# EasyEDA Pro project TTMT_ENTIRE_EASYEDA_PROJECT.epro, board PCB2
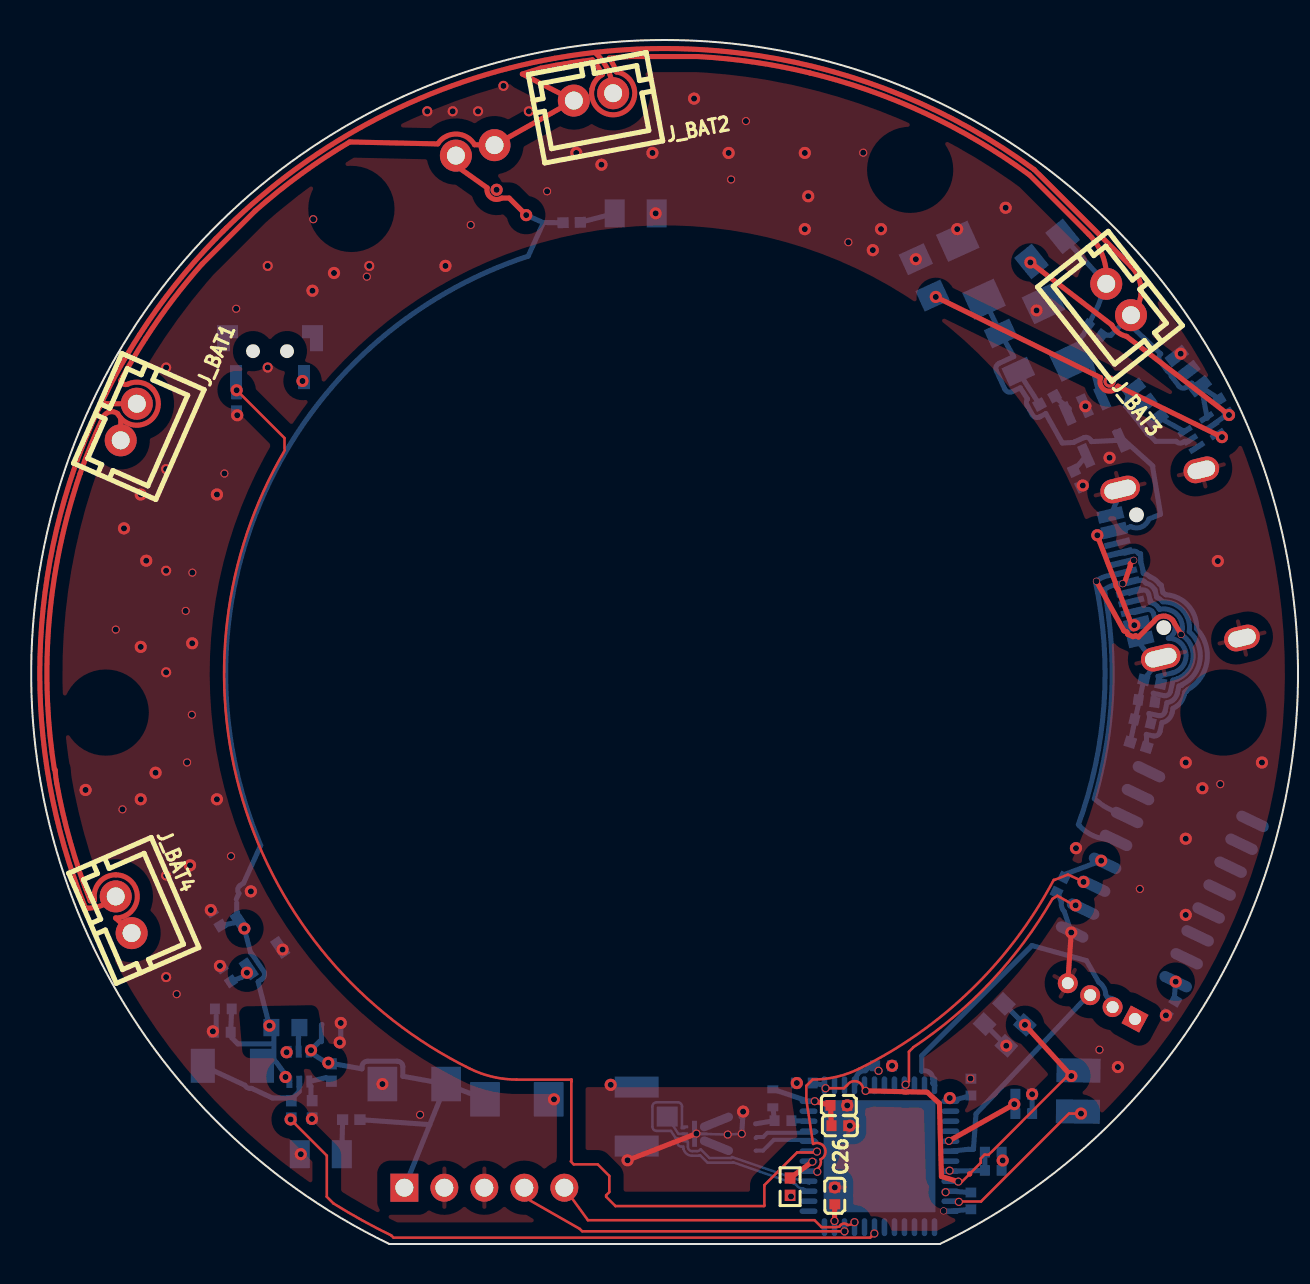
[diagram p10: board, top side]
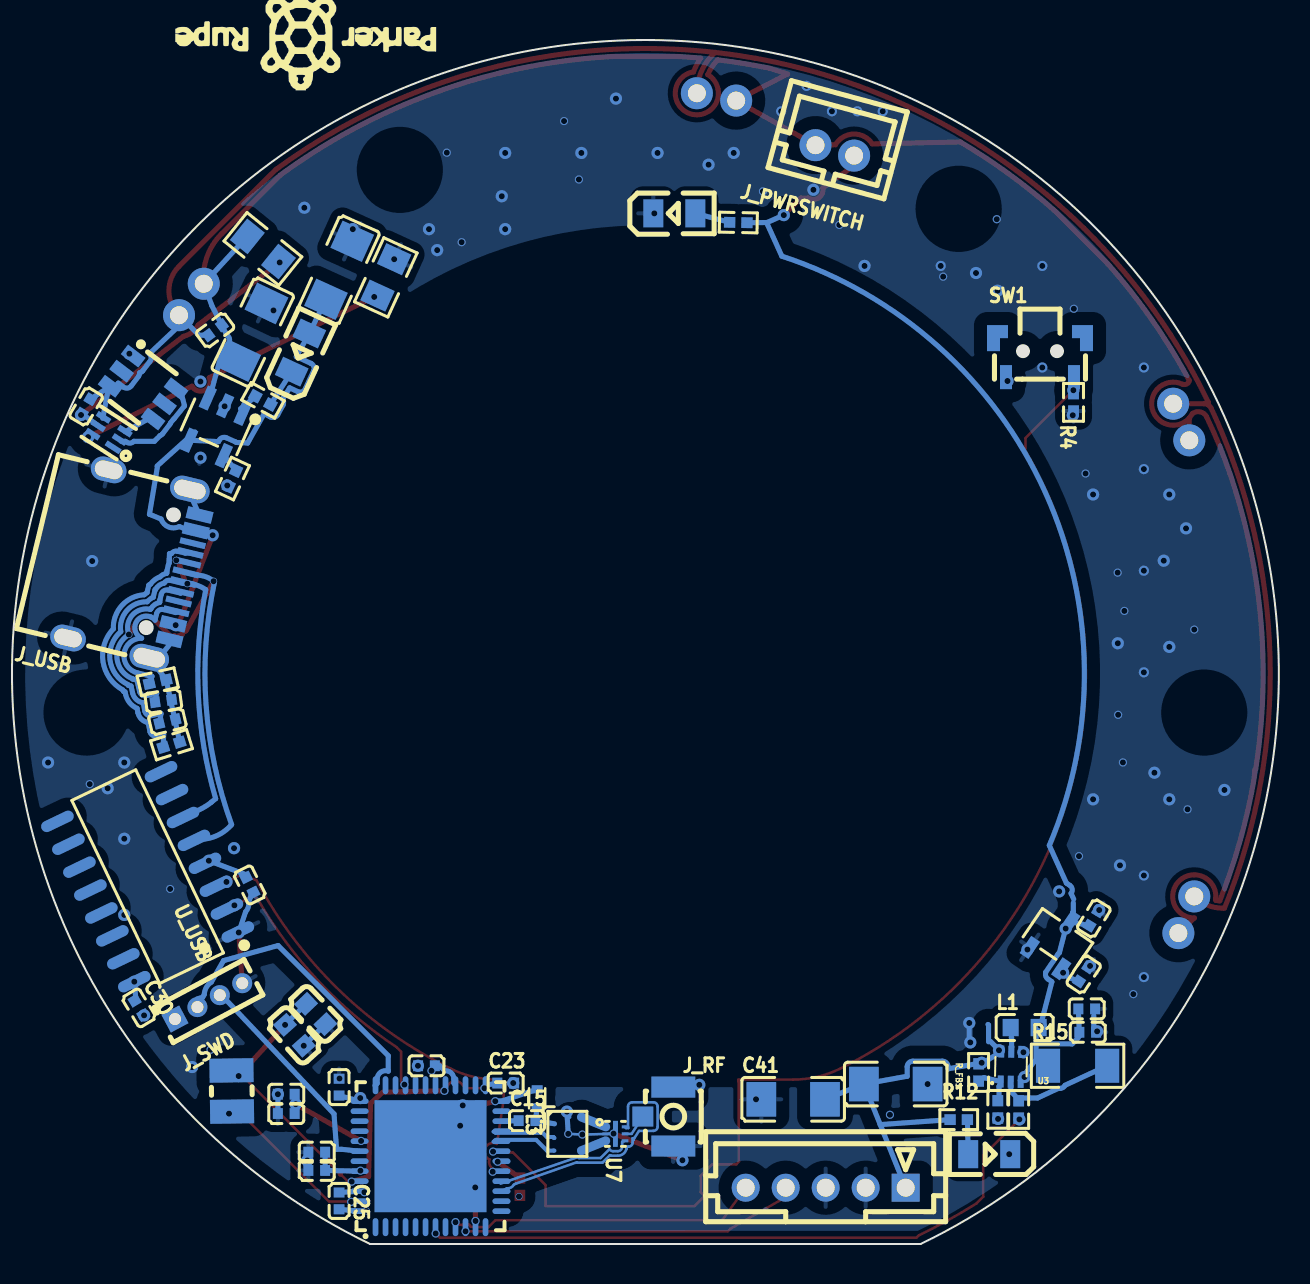
[diagram p11: board, bottom side, seen from below]

Outline 63.35 x 60.2 mm; copper layers: Top Layer, UpperGND, 3V3, Bottom Layer. Coordinates in mm from the lower left corner of the outline.
Outline path: 17.91,0 45.44,0 arc(31.67,60.2) 17.91,0
Stack: Top Layer 0.035mm Outer layer thickness 1oz / Dielectric1 0.2104mm 7628 RC49% 8.6mil / UpperGND 0.0152mm Inner layer thickness / Dielectric2 1.065mm 1.1mm H/HOZ Copper / 3V3 0.0152mm Inner layer thickness / Dielectric3 0.2104mm 7628 RC49% 8.6mil / Bottom Layer 0.035mm Outer layer thickness 1oz

## Design rules (mm)
net OUT2: DP1
net OUT1: DP1
template: Custom Config
spacing copperThickness1oz (default): track to track 0.025, other pairs 0.025 to 0.3
spacing copperThickness2oz: track to track 0.025, other pairs 0.025 to 0.3
track width copperThickness1oz (default): min 0.127, default 0.254, max 2.54
track width copperThickness2oz: min 0.203, default 0.254, max 2.54
differential pair RFpair (default): width min 0.445, default 0.445, max 0.445; gap min 0.203, default 0.203
via viaSize (default): diameter min 0.3, default 0.61, max 10; hole min 0.3, default 0.305, max 6.3

## Placement (name value [footprint] x y rotation side)
C7  10uF  [C0402]  53.19 45.69 143.4 bottom
C13  68pF  [C0402]  40.44 5.91 180 top
C15  12pF  [C0402]  37.59 6.17 180 bottom
C21  100nF  [C0402]  46.99 7.84 90 bottom
C22  100nF  [C0402]  42.62 8.91 0 bottom
C23  100nF  [C0402]  38.66 8.05 180 bottom
C24  100nF  [C0402]  48.11 4.59 0 bottom
C25  100nF  [C0402]  46.99 2.16 270 bottom
C26  100nF  [C0402]  40.18 2.41 270 top
C27  100nF  [C0402]  9.24 16.28 301.1 bottom
C28  100nF  [C0402]  9.75 13.48 303.7 bottom
C29  100nF  [C0402]  51.46 17.95 63.4 bottom
C30  100nF  [C0402]  57 11.81 239 bottom
C31  1uF  [C0402]  49.63 7.49 0 bottom
C33  10nF  [C0402]  49.63 6.52 0 bottom
C34  4.7uF  [C0402]  48.11 3.68 0 bottom
C35  470nF  [C0603]  48.16 11.5 226.3 bottom
C36  470nF  [C0603]  49.22 10.44 228.2 bottom
C37  47nF  [C0402]  40.39 6.93 180 top
C38  4.7uF  [C1206]  51.31 45.59 295.4 bottom
C39  4.7uF  [C1206]  46.99 48.69 114.4 bottom
C40  100nF  [C0402]  59.64 41.88 301 bottom
C41  22uF  [C1206]  24.28 7.24 180 bottom
C42  22uF  [C1206]  19.15 8 0 bottom
C43  1uF  [C0402]  9.6 11.76 0 bottom
C44  10uF  [C0402]  9.55 10.59 0 bottom
C45  10uF  [C0402]  55.78 27.15 172 bottom
C46  10uF  [C0402]  55.57 26.13 166.5 bottom
FL1  BALFHB-WL-05D3  [CSPG-8_L2.1-W1.8_BALFHB-WL-03D3]  35.56 5.51 180 bottom
J_BAT1  B2B-PH-K-S(LF)(SN)  [CONN-TH_B2B-PH-K-S]  4.87 41.1 246.2 top
J_BAT2  B2B-PH-K-S(LF)(SN)  [CONN-TH_B2B-PH-K-S]  28.11 57.36 190.6 top
J_BAT3  B2B-PH-K-S(LF)(SN)  [CONN-TH_B2B-PH-K-S]  54.38 47.23 128.2 top
J_BAT4  B2B-PH-K-S(LF)(SN)  [CONN-TH_B2B-PH-K-S]  4.62 16.46 293.4 top
J_CAM  B5B-PH-K-S(LF)(SN)  [CONN-TH_B5B-PH-K-S-LF-SN]  22.66 2.81 180 bottom
J_PWRSWITCH  B2B-PH-K-S(LF)(SN)  [CONN-TH_B2B-PH-K-S]  22.2 54.68 195.1 bottom
J_RF  6GHz  [IPEX-SMD_BWIPX-1-001E]  31.04 6.37 180 bottom
J_SWD  PZ127V-11-04-0720  [HDR-TH_4P-P1.27-V-M]  53.51 12.14 152 bottom
J_USB  TYPE-C-31-M-12  [USB-C_SMD-TYPE-C-31-M-12_1]  57.12 33.92 283.6 bottom
L1  1uH  [L0603]  12.7 10.82 180 bottom
L3  3.9nH  [IND-SMD_L1.0-W0.5-2]  37.08 7.29 90 bottom
L_SMPS  15uH  [IND-SMD_L2.5-W2.0]  52.36 7.65 269.2 bottom
LED4  KT-0805G  [LED0805-R-RD]  48.92 44.57 114.8 bottom
LED5  KT-0805G  [LED0805-R-RD]  30.23 51.53 180 bottom
LED6  KT-0805G  [LED0805-R-RD]  14.48 4.49 0 bottom
Q_BMS  FS8205A  [SOT-23-6_L2.9-W1.6-P0.95-LS2.8-BR]  56.79 42.83 37.3 bottom
R4  10kΩ  [R0402]  10.26 42.08 90 bottom
R5  10kΩ  [R0402]  37.95 2.87 90 top
R6  5.1kΩ  [R0402]  55.37 24.96 342.7 bottom
R7  5.1kΩ  [R0402]  56.06 28.11 347.2 bottom
R8  1kΩ  [R0402]  27.02 51.08 181.2 bottom
R9  2kΩ  [R0402]  52.32 38.27 115 bottom
R10  330Ω  [R0805]  50.8 49.75 38.9 bottom
R11  2.2kΩ  [R0805]  44.65 48.33 114.6 bottom
R12  1kΩ  [R0402]  16 6.22 180 bottom
R13  10kΩ  [R0402]  14.05 6.73 90 bottom
R14  10kΩ  [R0402]  13 6.73 90 bottom
R15  100kΩ  [R1206]  10.06 8.91 180 bottom
R_FB1  73.2kΩ  [R0402]  15.01 8.58 270 bottom
R_STAT  470Ω  [R0402]  50.8 42.18 28.8 bottom
SW1  TS24CA  [SW-SMD_2P-TS24CA]  11.94 44.32 180 bottom
U2  MCP73831T-2ACI/OT  [SOT-23-5_L3.0-W1.7-P0.95-LS2.8-BL]  53.16 40.86 23.9 bottom
U3  TPS61023DRLR  [SOT-563_L1.6-W1.2-P0.50-LS1.6-BR]  13.39 8.87 271.1 bottom
U4  XC6206P332MR  [SOT-23-3_L3.0-W1.7-P0.95-LS2.9-BR]  11.04 15.21 304.3 bottom
U6  BQ29700DSER  [WSON-6_L1.5-W1.5-P0.50-TL]  58.51 40.57 32.8 bottom
U7  SKY13351-378LF  [DFN-6_L1.0-W1.0-P0.35-BL-EP0.15]  33.17 5.51 270 bottom
U8  STM32WLE5CCU6  [UFQFPN-48_L7.0-W7.0-P0.50-BL-EP5.6]  42.42 4.39 180 bottom
U_USB  CH340C  [SOP-16_L10.0-W3.9-P1.27-LS6.0-BL]  56.56 18.37 64.4 bottom

## Footprints (pads in the part's own frame, mm; a bottom-side part is the same pattern mirrored in y, then rotated)
C0402
  rect 0.5x0.54 smd: 1(-0.42,0) 2(0.42,0)
C0603
  rect 0.8x0.9 smd: 1(-0.7,0) 2(0.7,0)
C1206
  rect 1.485x1.728 smd: 1(-1.593,0) 2(1.593,0)
CONN-TH_B2B-PH-K-S
  round 1.6 hole 0.9: 1(1,0) 2(-1,0)
CONN-TH_B5B-PH-K-S-LF-SN
  rect 1.4x1.4 hole 0.9: 1(4,0)
  round 1.4 hole 0.9: 2(2,0) 3(0,0) 4(-2,0) 5(-4,0)
CSPG-8_L2.1-W1.8_BALFHB-WL-03D3
  round 0.204 smd: A1(-0.69,0.5) A2(-0.69,-0.21) A3(-0.69,-0.84) B1(0.085,0.84) B2(0,0) C1(0.69,0.84) C2(0.69,0) C3(0.69,-0.84)
DFN-6_L1.0-W1.0-P0.35-BL-EP0.15
  rect 0.15x0.33 smd: 1(-0.35,-0.485) 3(0.35,-0.485) 4(0.35,0.485) 5(0,0.485) 6(-0.35,0.485)
  custom 1.3x0.78 smd: 2(0,-0.263)
HDR-TH_4P-P1.27-V-M
  rect 1x1 hole 0.6: 1(-1.905,0)
  round 1 hole 0.6: 2(-0.635,0) 3(0.635,0) 4(1.905,0)
IND-SMD_L1.0-W0.5-2
  rect 0.4x0.55 smd: 1(-0.45,0) 2(0.45,0)
IND-SMD_L2.5-W2.0
  rect 1.2x2.2 smd: 1(1.028,0) 2(-1.028,0)
IPEX-SMD_BWIPX-1-001E
  rect 1.05x1 smd: 1(-0.762,0)
  rect 2.2x1.05 smd: 2(0.762,-1.475) 3(0.762,1.475)
L0603
  rect 0.8x0.864 smd: 1(-0.7,0) 2(0.7,0)
LED0805-R-RD
  rect 1x1.399 smd: 1(1.05,0) 2(-1.05,0)
R0402
  rect 0.566x0.54 smd: 1(-0.433,0) 2(0.433,0)
R0805
  rect 1.133x1.377 smd: 1(-1,0) 2(1,0)
R1206
  rect 1.208x1.701 smd: 1(-1.479,0) 2(1.479,0)
SOP-16_L10.0-W3.9-P1.27-LS6.0-BL
  oval 0.56x1.745 smd: 1(-4.445,-2.873) 2(-3.175,-2.873) 3(-1.905,-2.873) 4(-0.635,-2.873) 5(0.635,-2.873) 6(1.905,-2.873) 7(3.175,-2.873) 8(4.445,-2.873) 9(4.445,2.873) 10(3.175,2.873) 11(1.905,2.873) 12(0.635,2.873) 13(-0.635,2.873) 14(-1.905,2.873) 15(-3.175,2.873) 16(-4.445,2.873)
SOT-23-3_L3.0-W1.7-P0.95-LS2.9-BR
  rect 1.038x0.532 smd: 1(1.101,-0.95) 2(1.101,0.95) 3(-1.101,0)
SOT-23-5_L3.0-W1.7-P0.95-LS2.8-BL
  rect 0.49x1.157 smd: 1(-0.95,-1.153) 2(0,-1.153) 3(0.95,-1.153)
  rect 0.49x1.175 smd: 4(0.95,1.153) 5(-0.95,1.153)
SOT-23-6_L2.9-W1.6-P0.95-LS2.8-BR
  rect 1.1x0.6 smd: 1(1.35,-0.95) 2(1.35,0) 3(1.35,0.95) 4(-1.35,0.95) 5(-1.35,0) 6(-1.35,-0.95)
SOT-563_L1.6-W1.2-P0.50-LS1.6-BR
  rect 0.6x0.3 smd: 1(0.75,-0.5) 2(0.75,0) 3(0.75,0.5) 4(-0.75,0.5) 5(-0.75,0) 6(-0.75,-0.5)
SW-SMD_2P-TS24CA
  rect 0.6x1.2 smd: 1(-1.7,-0.975) 2(1.7,-0.975)
  custom 1.05x1.3 smd: 3(2.125,0.975) 4(-2.125,0.975)
UFQFPN-48_L7.0-W7.0-P0.50-BL-EP5.6
  oval 0.28x0.9 smd: 1(-2.751,-3.547) 2(-2.251,-3.547) 3(-1.75,-3.547) 4(-1.25,-3.547) 5(-0.75,-3.547) 6(-0.249,-3.547) 7(0.249,-3.547) 8(0.75,-3.547) 9(1.25,-3.547) 10(1.75,-3.547) 11(2.251,-3.547) 12(2.751,-3.547) 25(2.751,3.547) 26(2.251,3.547) 27(1.75,3.547) 28(1.25,3.547) 29(0.75,3.547) 30(0.249,3.547) 31(-0.249,3.547) 32(-0.75,3.547) 33(-1.25,3.547) 34(-1.75,3.547) 35(-2.251,3.547) 36(-2.751,3.547)
  oval 0.9x0.28 smd: 13(3.547,-2.75) 14(3.547,-2.25) 15(3.547,-1.75) 16(3.547,-1.25) 17(3.547,-0.75) 18(3.547,-0.25) 19(3.547,0.25) 20(3.547,0.75) 21(3.547,1.25) 22(3.547,1.75) 23(3.547,2.25) 24(3.547,2.75) 37(-3.547,2.751) 38(-3.547,2.251) 39(-3.547,1.75) 40(-3.547,1.25) 41(-3.547,0.75) 42(-3.547,0.249) 43(-3.547,-0.249) 44(-3.547,-0.75) 45(-3.547,-1.25) 46(-3.547,-1.75) 47(-3.547,-2.251) 48(-3.547,-2.751)
  rect 5.6x5.6 smd: 49(0,0)
USB-C_SMD-TYPE-C-31-M-12_1
  oval 1.2x2 hole 0.8x1.6: 1(4.325,1.706) 4(-4.325,1.706)
  oval 1.2x1.8 hole 0.8x1.4: 2(4.325,-2.474) 3(-4.325,-2.474)
  custom 0.6x1.3 smd: A1B12(-3.2,2.474) A4B9(-2.4,2.474) B1A12(3.2,2.474) B4A9(2.401,2.474)
  rect 0.3x1.3 smd: A5(-1.25,2.474) A6(-0.25,2.474) A7(0.25,2.474) A8(1.25,2.474) B5(1.75,2.474) B6(0.75,2.474) B7(-0.75,2.474) B8(-1.75,2.474)
WSON-6_L1.5-W1.5-P0.50-TL
  rect 0.84x0.28 smd: 1(-0.581,0.5)
  rect 0.75x0.28 smd: 2(-0.636,0) 3(-0.636,-0.5) 4(0.636,-0.5) 5(0.636,0) 6(0.636,0.5)

## Nets
As in the schematic.

Pads without a net: J_USB A8 B8; Q_BMS 2 5; SW1 3 4; U6 1; U8 1 2 3 4 5 6 8 12 13 14 23 26 27 30 31 32 34 35 38 39 40 43; U_USB 7 8 9 10 11 12 13 14 15

## Via types
v1: diameter 0.406, hole 0.305, Top Layer to Bottom Layer, 43 vias
v2: diameter 0.61, hole 0.305, Top Layer to Bottom Layer, 94 vias
v3: diameter 0.508, hole 0.305, Top Layer to Bottom Layer, 14 vias
v4: diameter 0.355, hole 0.305, Top Layer to Bottom Layer, 6 vias

## Routing (per net, layer and track width the routed paths; a pad name or vN(x,y) marks a point on that pad's centre or on a via; arc(x,y) is an arc through that point)
3V3: length 12.6
  Top Layer w0.254: v1(45.89,5.15) v2(49.16,6.99) ; v1(40.17,1.15) C26.2
  Bottom Layer w0.254: C22.1 41.96,8.91 41.71,8.66 arc(41.39,8.56) 41.25,8.25 41.25,8.05 U8.28 ; C28.2 10.51,13.33 v2(10.78,13.56) ; v2(57.23,13.12) 57.15,12.18 ; C25.1 U8.46 ; U8.37 C21.1 ; 47.69,4.39 C34.1 U8.44
  vias: v1(42.37,8.66) v1(45.73,2.59) v1(45.92,3.67) v2(13.56,43.15) v2(45.93,7.3) v4(37.99,2.38)
GND: length 24.4
  Top Layer w0.254: v2(29.82,4.19) v1(33.26,5.52) ; J_SWD.4 v2(52.01,15.58)
  Bottom Layer w0.127: v1(35.53,5.51) v1(34.83,5.47) U7.2
  Bottom Layer w0.254: 55.41,30.04 55.75,29.61 ; 51.32,17.66 51.51,17.08 arc(51.53,16.83) 51.66,16.61 v2(52.01,15.58) ; v2(35.6,6.62) v1(35.53,5.51) ; C35.2 v2(48.76,9.91) ; J_USB.1 R7.1 54.96,25.09 ; v2(15.47,11.05) 15.47,10.13 v2(15.42,10.08) ; v2(9.08,10.63) 9.25,10.8 9.25,11.41 ; 54.01,36.5 54.31,37.2 ; C33.2 v2(50.05,7.49) ; C24.2 C34.2 ; 46.99,1.73 45.96,1.64 ; 54.01,37.39 54.09,37.95
  vias: v1(4.22,30.72) v1(4.56,21.73) v1(7.27,12.49) v1(7.72,31.66) v1(7.79,24.08) v1(8.05,33.57) v1(8.03,26.46) v1(9.66,38.53) v1(9.99,19.39) v1(10.25,46.76) v1(14.1,51.24) v1(16.78,48.37) v1(19.44,6.46) v1(21.97,50.95) v1(25.79,52.63) v1(35,53.23) v1(35.74,56.15) v1(40.86,50.09) v1(41.6,54.57) v1(46.97,8.27) v1(53.42,9.71) v1(55.44,17.75) v1(59.46,22.99) v2(2.71,22.7) v2(4.63,35.78) v2(5.47,37.48) v2(5.47,29.86) v2(5.47,22.24) v2(5.75,34.17) v2(6.21,23.56) v2(7.94,18.93) v2(8.05,30.04) v2(8.98,16.7) v2(9.28,37.48) v2(9.28,22.24) v2(9.43,13.9) v2(10.3,41.44) v2(10.98,17.63) v2(12.57,14.72) v2(12.77,9.59) v2(13.48,4.49) v2(14.06,47.67) v2(14.03,6.25) v2(15.14,48.55) v2(17.56,8) v2(20.71,48.91) v2(23.27,52.71) v2(26.14,7.24) v2(27.25,54.55) v2(28.51,53.97) v2(28.98,7.96) v2(31.06,54.55) v2(31.23,51.53) v2(33.14,57.27) v2(34.87,54.55) v2(38.28,8.05) v2(38.68,54.55) v2(38.68,50.74) v2(38.85,52.39) v2(40.18,2.83) v2(40.81,6.93) v2(40.94,5.91) v2(42.08,49.7) v2(42.49,50.74) v2(43.05,8.91) v2(44.24,49.24) v2(46.3,50.74) v2(48.58,4.18) v2(48.73,51.81) v2(50.27,46.68) v2(52.24,19.79) v2(52.58,37.93) v2(52.71,41.89) v2(53.92,43.12) v2(53.92,39.31) v2(54.34,8.85) v2(56.74,11.43) v2(57.48,44.52) v2(57.73,24.07) v2(57.73,20.26) v2(57.73,16.45) v2(58.56,22.79) v2(59.34,34.15) v2(61.54,24.07) v3(6.74,43.83) v3(6.74,38.75) v3(6.74,33.67) v3(6.74,28.59) v3(6.74,18.43) v3(6.74,13.35) v3(11.82,48.91) v3(11.82,43.83) v3(16.9,48.91) v3(19.8,56.64) v3(21.07,56.64) v3(22.34,56.64) v3(23.61,57.91) v3(24.88,56.64) v4(45.62,1.66)
V5_CAM: length 20.7
  Bottom Layer w0.254: C42.2 19.93,5.97 ; C42.2 C41.2 ; C42.2 18.58,8.39 18.58,8.86 arc(18.5,9.06) 18.3,9.14 16.82,9.14 arc(16.62,9.06) 16.54,8.86 16.54,8.76 v2(14.85,9.06) ; 19.93,5.97 R12.1 ; 19.93,5.97 J_CAM.1 ; 14.18,9.9 14.43,10.14 ; 14.8,9.15 14.67,9.12 U3.6 ; 14.51,10.11 14.51,10.95 14.54,10.98 ; 13.91,9.62 14.18,9.89
  vias: v2(13.99,9.69)
VBAT: length 60.8
  Top Layer w0.254: v2(24.75,51.45) 23.9,52.3 23.54,52.3 ; 21.16,53.98 22.8,52.81 arc(22.99,52.32) 23.52,52.3
  Bottom Layer w0.254: C27.2 U4.3 ; v2(24.75,51.45) 25.59,51.08 R8.2 ; 12.92,8.17 12.31,9.01 ; v2(10.65,15.77) 10.97,14.56 arc(11,14.53) 11.03,14.5 11.65,13.59 11.66,13.53 arc(11.64,13.37) 11.54,13.25 11.37,13.13 11.34,13.1 v2(11.91,10.92) ; 10.27,17.05 10.27,16.62 10.31,16.58 ; 10.02,10.31 10.33,10.01 12.05,10.01 ; 25.61,51.07 24.85,49.39 arc(11.68,37.6) 11.47,19.93 10.62,18.05 10.45,17.93 arc(10.33,17.75) 10.37,17.54 10.38,17.53 10.25,17.24 ; 12.26,9.07 12.13,9.2 12.13,10.56 ; 9.96,10.4 C43.2
  vias: v2(12.71,8.35)
VBUS_5V: length 25.7
  Top Layer w0.254: 55.11,30.75 54.34,32.75 arc(54.25,32.89) 54.22,33.05 53.33,35.38
  Bottom Layer w0.254: 54.27,40.53 54.2,40.6 ; 56.09,38.9 54.32,40.49 ; C39.1 48.48,45.53 49.13,44.37 48.4,44.03 arc(48.25,43.88) 48.26,43.66 48.68,42.75 arc(48.84,42.61) 49.05,42.62 49.46,42.81 49.82,42.25 arc(49.76,42.1) 49.8,41.94 50.06,41.47 arc(50.22,41.34) 50.44,41.36 50.73,41.52 51.56,40.05 52.12,40.08 arc(52.15,40.1) 52.18,40.11 52.63,40.31 arc(52.84,40.32) 53,40.17 53.02,40.12 U2.4 ; 56.47,36.49 55.89,36.25 arc(55.52,35.85) 54.98,35.87 54.34,35.61 ; 56.08,38.82 56.47,36.49
  vias: v2(53.31,35.44) v2(55.16,30.94)
VDDRF1V55: length 24.3
  Top Layer w0.127: 46.37,3.05 46.47,3.05 46.93,3.5 ; 40.79,7.94 40.64,7.79 v1(39.72,7.79) ; 46.93,3.51 47.48,4.06 47.48,4.27 47.67,4.47 47.88,4.47 51.81,8.4 v2(52.01,8.4) ; v1(41.72,7.66) 41.6,7.79 arc(41.25,8.14) 40.81,7.94
  Top Layer w0.254: v1(46.36,3.12) 45.52,3.37 45.41,7.03 44.8,7.59 43.86,7.61 arc(43.72,7.59) 43.58,7.62 v1(41.72,7.66) ; 46.93,3.51 46.93,3.5 46.93,3.51 ; v2(49.69,10.96) v2(52.01,8.4)
  Bottom Layer w0.254: C35.1 v2(49.69,10.96) ; C23.1 U8.25
BOOST_EN: length 32.7
  Top Layer w0.127: 42,0.36 41.95,0.32 18.11,0.32 18,0.43 arc(16.54,1.19) 15.11,2.03 14.77,2.37 ; 42,0.36 v1(42.16,0.53) ; 42,0.36 42.01,0.36 ; v2(12.97,6.23) 14.78,4.42 14.78,2.37
BOOT0: length 65
  Top Layer w0.127: 27,4.17 27,8.11 27.02,8.12 27.02,8.22 24.27,8.22 arc(23.07,8.36) 21.94,8.76 arc(10.57,22.21) 12.68,39.69 ; 39.11,4.58 38.3,4.58 36.66,2.94 36.66,1.92 36.64,1.9 29.21,1.9 28.75,2.36 28.75,2.44 28.9,2.59 28.9,3.41 28.33,3.98 27.13,3.98 26.98,4.13 ; 12.66,39.76 12.66,40.3 v2(10.27,42.69)
  vias: v1(39.29,4.62)
CH340C_RX: length 23.1
  Top Layer w0.127: 51.18,18.2 51.13,18.2 arc(47.01,12.72) 41.4,8.76 arc(40.27,8.36) 39.07,8.22 38.76,7.91 38.76,7.22 39.1,5 arc(39.67,4.81) 39.48,4.24 arc(39.48,4.23) 39.47,4.23 arc(39.46,3.96) 39.29,3.75 v1(39.31,3.61) ; 51.2,18.22 51.84,18.47 52.53,18.16
  vias: v2(52.62,18.1)
CH340C_TX: length 13.5
  Top Layer w0.127: v1(43.72,7.97) 43.89,8.13 43.89,9.62 44.1,9.82 ; 51.31,17.41 51.07,17.26 arc(48.01,13.14) 44.1,9.83 ; 52.14,16.94 51.31,17.41
  vias: v2(52.23,16.93)
OUT1: length 1.3
  Bottom Layer w0.445: U7.1 FL1.C1
OUT2: length 1.3
  Bottom Layer w0.445: U7.3 FL1.C3
RFI_N: length 3.2
  Bottom Layer w0.2: 36.22,5.3 36.27,5.35 36.6,5.35 36.81,5.56 39.16,5.56 39.22,5.61 39.27,5.61
RFI_P: length 3.3
  Bottom Layer w0.2: 39.27,5.11 39.23,5.11 39.13,5.21 37.13,5.21 36.6,4.67 36.22,4.67
RFO_LP: length 0.9
  Bottom Layer w0.254: C15.1 U8.22
RUNCAM_RX: length 16.2
  Top Layer w0.127: 24.89,2.21 27.43,0.76 27.55,0.63 v1(40.67,0.63)
RUNCAM_TX: length 15.4
  Top Layer w0.127: 40.09,0.84 39.52,0.84 39.17,1.19 27.84,1.19 J_CAM.5 ; 40.15,0.83 40.42,0.87 40.47,0.94 arc(40.61,1.02) 40.77,0.99 40.83,0.95 41.03,0.98
  vias: v1(41.17,1.09)
SWD_CLK: length 11.2
  Bottom Layer w0.254: 45.96,4.64 46.86,4.74 47.12,4.74 47.24,6.51 52.91,12.49
SWD_IO: length 15
  Bottom Layer w0.254: 54.08,12.26 53.81,12.33 53.73,12.47 arc(53.63,12.83) 53.38,13.1 52.77,14.17 50.04,14.92 44.53,9.41 44.53,8.64 arc(44.91,8.59) 45.09,8.25 45.09,8.03 45.19,7.93
U_USB_D+: length 31.5
  Top Layer w0.254: v4(53.27,33.14) 54.65,30.66 54.79,30.6 54.83,30.49 55.1,30.37 55.22,30.42 55.37,30.35 56.15,31.14 arc(56.41,31.35) 56.74,31.39 arc(56.93,31.32) 57.09,31.18 arc(57.13,31.11) 57.17,31.04 v4(57.5,30.47)
  Bottom Layer w0.254: J_USB.B6 54.91,32.54 55.54,32.7 arc(55.76,32.66) 55.88,32.49 55.95,32.2 arc(55.96,32.15) 55.96,32.1 arc(55.96,32.09) 55.97,32.08 arc(56.22,31.97) 56.4,31.76 56.43,31.75 56.43,31.73 arc(57.35,31.43) v4(57.5,30.47) arc(58.1,29.31) 57.31,28.26 57.31,28.25 57.1,28.2 arc(57.09,28.18) 57.09,28.16 56.97,27.63 arc(56.85,27.46) 56.64,27.42 56.11,27.54 56.24,27.01 ; 54.09,33.44 arc(53.65,33.36) v4(53.27,33.14) arc(53.24,33.12) 53.22,33.1 arc(53.65,26.98) 52.36,20.97 arc(52.39,20.95) 52.41,20.92 arc(53.29,20.34) 54.33,20.27
U_USB_D-: length 25.5
  Top Layer w0.254: 54.65,33 54.91,33.74 arc(54.92,33.82) 54.96,33.89 54.96,34.01 v4(55.13,34.19)
  Bottom Layer w0.254: 54.78,33.1 54.79,33.03 55.43,33.18 arc(55.6,33.17) 55.74,33.05 arc(55.98,32.94) 56.16,32.74 56.19,32.72 56.28,32.34 arc(56.45,32.24) 56.59,32.11 arc(57.6,31.68) 57.91,30.62 arc(58.45,29.2) 57.56,27.98 57.53,27.94 57.4,27.9 57.32,27.55 arc(57.13,27.23) 56.79,27.06 56.7,26.64 arc(56.58,26.46) 56.37,26.42 55.9,26.52 55.99,25.99 ; 54.6,33.02 arc(54.11,32.94) 53.67,32.72 arc(53.67,32.72) 53.66,32.72 arc(54.03,27.46) 53.16,22.27 arc(53.27,22.17) 53.38,22.08 arc(53.94,21.73) 54.55,21.51
  vias: v4(54.58,33.02)
VCTL1: length 7.1
  Bottom Layer w0.127: U7.4 32.83,5.11 32.84,4.86 arc(32.9,4.7) 33.05,4.64 33.29,4.64 arc(33.39,4.67) 33.47,4.74 33.91,4.3 34.99,4.3 35.04,4.35 38.91,3.02
VCTL2: length 13.2
  Bottom Layer w0.127: U8.15 38.59,2.78 38.56,2.78 arc(38.38,2.83) 38.25,2.97 38.15,3.02 35.11,4.08 35.09,4.07 33.82,4.07 33.44,4.44 arc(33.42,4.43) 33.4,4.43 33.39,4.41 33.05,4.41 arc(32.78,4.51) 32.62,4.75 32.61,4.76 32.61,4.87 32.52,4.87 arc(32.37,4.93) 32.31,5.08 32.31,5.18 32.26,5.2 32.31,5.28 32.22,5.3 31.99,5.66 31.28,5.66 arc(31.12,5.72) 31.06,5.87 31.06,6.87 arc(31.12,7.02) 31.28,7.09 32.33,7.09 arc(32.48,7.02) 32.54,6.87 32.54,5.87 arc(32.54,5.83) 32.53,5.8 32.65,5.8 U7.6
VR_PA: length 3.7
  Top Layer w0.254: C13.2 C37.2 v1(39.18,7.14)
  Bottom Layer w0.254: L3.2 U8.24
$1N8459: length 105.8
  Top Layer w0.254: J_BAT1.2 3.74,42.02 arc(3.62,42) 3.51,41.94 ; J_BAT3.2 arc(55.5,47.66) 55,48.88 50.16,53.72 arc(43.59,57.41) 36.33,59.43 arc(32.26,59.77) 28.18,59.58 ; 3.51,41.94 arc(3.43,41.87) 3.38,41.79 arc(0.43,29.36) 2.71,16.79 2.81,16.79 arc(3.57,16.95) J_BAT4.2 ; 3.51,41.94 arc(3.51,42.01) 3.51,42.07 arc(4.41,43.8) 5.41,45.47 arc(7.2,47.96) 9.23,50.27 arc(9.41,50.45) 9.59,50.63 9.75,50.79 arc(17.31,56.28) 26.17,59.29 arc(26.59,59.36) 27.01,59.43 arc(27.59,59.51) 28.18,59.58 ; 28.18,59.58 arc(28.86,58.66) J_BAT2.2
  Bottom Layer w0.254: 58.44,42.89 58.52,42.84 ; 58.52,42.84 C40.1 ; 58.52,42.84 58.81,41.29 ; J_BAT3.2 53.99,45.44 C7.1 ; 58.3,42.79 58.03,43.04 57.78,42.85 arc(57.57,42.8) 57.39,42.9 57.02,43.38 arc(56.98,43.46) 56.97,43.56 arc(56.88,43.59) 56.81,43.66 56.45,44.14 arc(56.39,44.33) 56.48,44.51 55.18,45.74
$1N8671: length 7.3
  Bottom Layer w0.254: 55.13,31.64 55.16,31.57 55.78,31.72 arc(55.99,31.69) 56.12,31.52 56.19,31.2 arc(56.29,31.29) 56.4,31.35 arc(57.16,31.05) 56.87,30.29 arc(57.74,29.52) 57.08,28.56 56.35,28.38 R7.2
$1N10027: length 5.4
  Bottom Layer w0.254: R15.2 10.68,7.94 arc(10.78,7.82) 10.93,7.78 11.02,7.78 12.06,7.3 12.96,7.3 12.99,7.27 ; 13.39,7.91 13.39,7.63 13.17,7.4
$1N10580: length 1.4
  Top Layer w0.254: R5.2 v1(39.06,4.11)
$1N10643: length 1.5
  Bottom Layer w0.254: 13.99,7.34 13.99,7.88 13.94,7.93 ; 14.78,8.28 14.73,8.31 U3.1
$1N11192: length 7.9
  Top Layer w0.127: 46.39,2.12 47.5,2.12 51.89,6.52 v2(52.5,6.52)
  vias: v1(46.39,2.11)
$1N14448: length 1.3
  Bottom Layer w0.254: 56.53,41.26 57.68,40.62
$1N14452: length 4.7
  Bottom Layer w0.254: 54.88,42.55 54.72,41.91 55.24,41.27 arc(55.26,41.24) 55.29,41.22 55.41,41.07 arc(55.43,41.03) 55.45,40.99 55.82,40.51 arc(55.87,40.45) 55.95,40.42 56.23,40.14 57.25,40.14 arc(57.42,40.05) 57.61,40.09 57.68,40.14 57.89,40.14
$1N14478: length 13.6
  Top Layer w0.254: v2(59.9,41.45) 54.77,45.39 arc(54.34,45.59) 54.03,45.95 v2(49.96,49.08)
  Bottom Layer w0.254: C40.2 U6.5
$1N16813: length 2
  Bottom Layer w0.254: R_STAT.1 LED4.2
$1N16873: length 0.9
  Bottom Layer w0.254: 51.92,41.76 51.25,42.3
$1N16949: length 1
  Bottom Layer w0.254: U2.5 R9.2
$1N29811: length 0.5
  Bottom Layer w0.254: 13.38,10.33 13.36,10.31 13.36,9.82
$1N38726: length 1.4
  Bottom Layer w0.127: J_RF.1 32.36,5.51 U7.5
$1N39154: length 1.6
  Bottom Layer w0.254: 36.22,6.01 37.17,6.17 L3.1
$1N39412: length 120.2
  Top Layer w0.254: 4.47,41.3 J_BAT1.1 ; 4.47,41.3 arc(4.39,41.4) 4.32,41.51 arc(3.92,41.61) 3.6,41.35 arc(2.98,39.96) 2.44,38.52 arc(1.33,34.34) 0.82,30.04 arc(0.78,28.53) 0.82,27.01 arc(0.94,25.37) 1.15,23.74 1.19,23.7 1.2,23.56 arc(1.23,23.31) 1.27,23.06 arc(1.96,20.06) 2.95,17.16 arc(3.05,17.17) 3.15,17.19 arc(3.15,17.24) 3.15,17.29 arc(3.43,18.11) 4.23,18.46 arc(5.3,17.37) 4.22,16.3 arc(4.62,15.93) J_BAT4.1 ; 4.47,41.3 arc(5.99,41.21) 6.08,42.73 arc(5.5,43.07) 4.82,42.99 arc(4.6,43) 4.47,43.17 arc(5.07,44.24) 5.71,45.28 arc(7.06,47.19) 8.54,49 11.19,51.66 arc(13.48,53.49) 15.92,55.1 20.33,55.01 arc(21.26,55.5) 22.17,54.97 23.16,54.94 J_BAT2.1 24.56,58.5 25.47,58.79 arc(25.85,58.87) 26.23,58.94 arc(26.65,59.01) 27.06,59.07 arc(27.56,59.14) 28.06,59.21 arc(28.34,58.86) 28.55,58.47 arc(28.22,58.16) 28.04,57.75 arc(28.21,56.92) 28.93,56.47 arc(30.16,57.37) 29.26,58.61 arc(29.11,58.96) 28.91,59.3 arc(29.47,59.34) 30.03,59.38 33.31,59.38 arc(34.8,59.26) 36.28,59.07 arc(37.61,58.84) 38.94,58.55 arc(44.68,56.54) 49.92,53.45 52.88,50.5 arc(53.6,49.35) 53.76,48.01
  Bottom Layer w0.254: R10.2 53.76,48.01 53.35,46.91 52.61,45.46 52.56,45.41 arc(52.47,45.22) 52.53,45.02 52.82,44.7 53.35,42.75
$1N52640: length 2
  Bottom Layer w0.254: 51.6,18.45 v2(53.5,19.16)
$1N55894: length 14
  Bottom Layer w0.254: J_USB.A5 54.68,34.55 55.07,34.64 arc(55.24,34.63) 55.38,34.52 55.47,34.51 55.48,34.25 arc(55.49,34.2) 55.49,34.15 55.49,34.04 arc(55.51,33.99) 55.53,33.95 55.6,33.66 arc(55.61,33.61) 55.6,33.56 arc(55.61,33.54) 55.62,33.53 arc(55.79,33.47) 55.94,33.36 arc(56.21,33.21) 56.42,33 56.5,32.95 56.59,32.57 arc(56.67,32.52) 56.74,32.46 arc(57.85,31.93) 58.28,30.76 arc(58.8,29.12) 57.81,27.71 57.76,27.62 57.69,27.61 57.66,27.47 arc(57.46,27.06) 57.1,26.78 57.05,26.56 arc(56.87,26.24) 56.54,26.07 56.45,25.62 arc(56.32,25.44) 56.11,25.4 55.76,25.48 55.78,24.83
$1N56184: length 1.8
  Bottom Layer w0.254: 27.46,51.08 LED5.1
$1N56591: length 16.4
  Top Layer w0.254: v2(45.23,47.35) 53.48,43.31 arc(53.71,42.69) 54.35,42.89 v2(59.54,40.35)
$1N56873: length 1.7
  Bottom Layer w0.254: R12.2 LED6.1

## Copper pours and planes (outline as drawn; the poured copper is in the pictures)
3V3 on 3V3: 0.01,60.19 63.34,60.19 63.34,0.01 0.01,0.01
GND on Top Layer: 45.44,0 31.67,60.2 17.91,0
GND on Bottom Layer: 45.44,0 31.67,60.2 17.91,0
GND on Bottom Layer: 29.28,16.19 39.92,16.19 39.92,-1.94 29.28,-1.94
GND on UpperGND: 0.01,60.19 63.34,60.19 63.34,0.01 0.01,0.01

Small or netless copper shapes (teardrops, artwork), in the pictures only: 28 on UpperGND, 4 on 3V3
